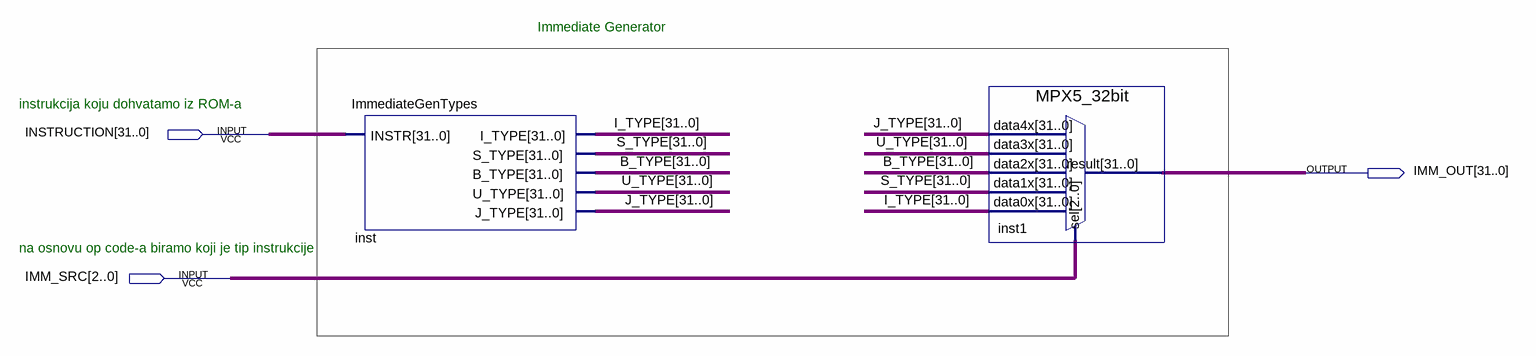
[diagram p0: schematic sheet]
// Quartus schematic ImmediateGenerator.bdf as structural Verilog: 2 symbols, 3 pins
module ImmediateGenerator (
  input  [31:0] INSTRUCTION,
  input  [2:0] IMM_SRC,
  output [31:0] IMM_OUT
);

  wire [31:0] B_TYPE, I_TYPE, J_TYPE, S_TYPE, U_TYPE;

  ImmediateGenTypes inst (
    .INSTR(INSTRUCTION), .I_TYPE(I_TYPE), .S_TYPE(S_TYPE), .B_TYPE(B_TYPE), .U_TYPE(U_TYPE), .J_TYPE(J_TYPE));
  MPX5_32bit inst1 (
    .data4x(J_TYPE), .data3x(U_TYPE), .data2x(B_TYPE), .data1x(S_TYPE), .data0x(I_TYPE), .sel(IMM_SRC),
    .result(IMM_OUT));

  // Notes on the sheet:
  //   Immediate Generator
  //   instrukcija koju dohvatamo iz ROM-a
  //   na osnovu op code-a biramo koji je tip instrukcije
endmodule
